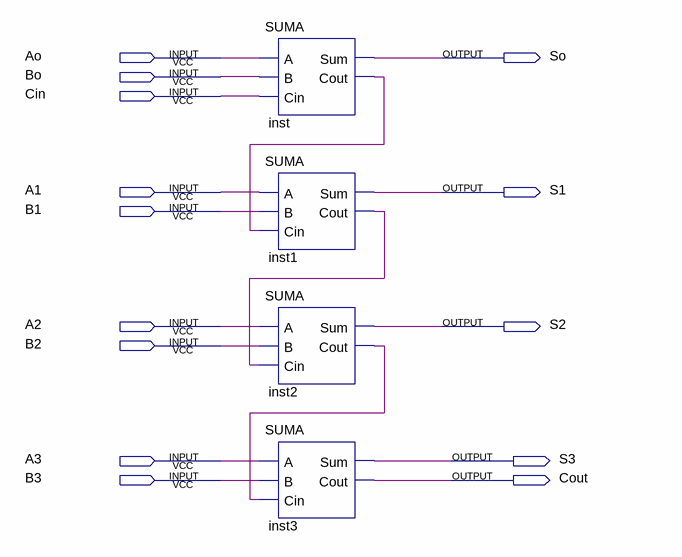
[diagram p0: schematic sheet]
// Quartus schematic SUMADOR.bdf as structural Verilog: 4 symbols, 14 pins
module SUMADOR (
  input  Ao,
  input  Bo,
  input  Cin,
  input  A1,
  input  B1,
  input  A2,
  input  B2,
  input  A3,
  input  B3,
  output So,
  output S1,
  output S2,
  output S3,
  output Cout
);

  wire inst1_cout, inst2_cout, inst_cout;

  SUMA inst (.A(Ao), .B(Bo), .Cin(Cin), .Sum(So), .Cout(inst_cout));
  SUMA inst1 (.A(A1), .B(B1), .Cin(inst_cout), .Sum(S1), .Cout(inst1_cout));
  SUMA inst2 (.A(A2), .B(B2), .Cin(inst1_cout), .Sum(S2), .Cout(inst2_cout));
  SUMA inst3 (.A(A3), .B(B3), .Cin(inst2_cout), .Sum(S3), .Cout(Cout));
endmodule
